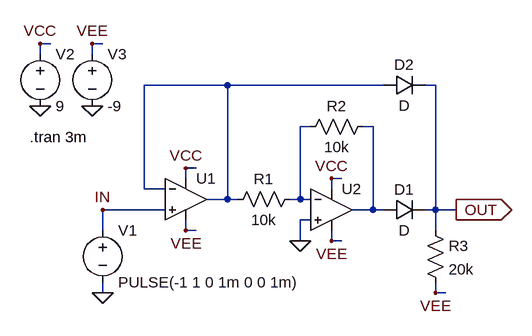
[diagram p0: schematic SAW_TRI_RayWilson_02.asc]
SAW_TRI_RayWilson_02.asc, the LTspice schematic file:
Version 4
SHEET 1 880 680
WIRE 0 -96 -16 -96
WIRE 80 -96 64 -96
WIRE -16 -80 -16 -96
WIRE 64 -80 64 -96
WIRE 272 -32 144 -32
WIRE 512 -32 272 -32
WIRE 592 -32 576 -32
WIRE 400 32 384 32
WIRE 496 32 480 32
WIRE 224 96 208 96
WIRE 208 112 208 96
WIRE 448 112 432 112
WIRE 144 128 144 -32
WIRE 176 128 144 128
WIRE 432 128 432 112
WIRE 272 144 272 -32
WIRE 272 144 240 144
WIRE 288 144 272 144
WIRE 384 144 384 32
WIRE 384 144 368 144
WIRE 400 144 384 144
WIRE 176 160 80 160
WIRE 496 160 496 32
WIRE 496 160 464 160
WIRE 512 160 496 160
WIRE 592 160 592 -32
WIRE 592 160 576 160
WIRE 624 160 592 160
WIRE 400 176 384 176
WIRE 80 192 80 160
WIRE 208 192 208 176
WIRE 224 192 208 192
WIRE 592 192 592 160
WIRE 384 208 384 176
WIRE 432 208 432 192
WIRE 448 208 432 208
WIRE 80 288 80 272
WIRE 592 288 592 272
WIRE 608 288 592 288
FLAG 208 96 VCC
FLAG 208 192 VEE
FLAG 384 208 0
FLAG 432 112 VCC
FLAG 432 208 VEE
FLAG 592 288 VEE
FLAG 80 288 0
FLAG 80 160 IN
FLAG -16 0 0
FLAG 64 0 0
FLAG -16 -96 VCC
FLAG 64 -96 VEE
FLAG 624 160 OUT
IOPIN 624 160 Out
SYMBOL Opamps\\UniversalOpamp2 208 144 R0
SYMATTR InstName U1
SYMBOL Opamps\\UniversalOpamp2 432 160 R0
SYMATTR InstName U2
SYMBOL res 384 128 R90
WINDOW 0 0 56 VBottom 2
WINDOW 3 32 56 VTop 2
SYMATTR InstName R1
SYMATTR Value 10k
SYMBOL res 496 16 R90
WINDOW 0 0 56 VBottom 2
WINDOW 3 32 56 VTop 2
SYMATTR InstName R2
SYMATTR Value 10k
SYMBOL diode 512 176 R270
WINDOW 0 32 32 VTop 2
WINDOW 3 0 32 VBottom 2
SYMATTR InstName D1
SYMBOL diode 512 -16 R270
WINDOW 0 32 32 VTop 2
WINDOW 3 0 32 VBottom 2
SYMATTR InstName D2
SYMBOL res 576 176 R0
SYMATTR InstName R3
SYMATTR Value 20k
SYMBOL voltage 80 176 R0
WINDOW 123 0 0 Left 2
WINDOW 39 0 0 Left 2
SYMATTR InstName V1
SYMATTR Value PULSE(-1 1 0 1m 0 0 1m)
SYMBOL voltage -16 -96 R0
WINDOW 123 0 0 Left 2
WINDOW 39 0 0 Left 2
SYMATTR InstName V2
SYMATTR Value 9
SYMBOL voltage 64 -96 R0
WINDOW 123 0 0 Left 2
WINDOW 39 0 0 Left 2
SYMATTR InstName V3
SYMATTR Value -9
TEXT -32 48 Left 2 !.tran 3m

The netlist it stands for:
* SAW_TRI_RayWilson_02.asc
XU1 IN N001 VCC VEE N001 level.2 Avol=1Meg GBW=10Meg Slew=10Meg ilimit=25m rail=0 Vos=0 phimargin=45 en=0 enk=0 in=0 ink=0 Rin=500Meg  ; pins IN+ IN- V+ V- OUT
XU2 0 N002 VCC VEE N003 level.2 Avol=1Meg GBW=10Meg Slew=10Meg ilimit=25m rail=0 Vos=0 phimargin=45 en=0 enk=0 in=0 ink=0 Rin=500Meg  ; pins IN+ IN- V+ V- OUT
R1 N002 N001 10k
R2 N003 N002 10k
D1 N003 OUT D
D2 N001 OUT D
R3 OUT VEE 20k
V1 IN 0 PULSE(-1 1 0 1m 0 0 1m)
V2 VCC 0 9
V3 VEE 0 -9
.model D D
.lib standard.dio
.tran 3m
.lib UniversalOpamps2.sub
.backanno
.end